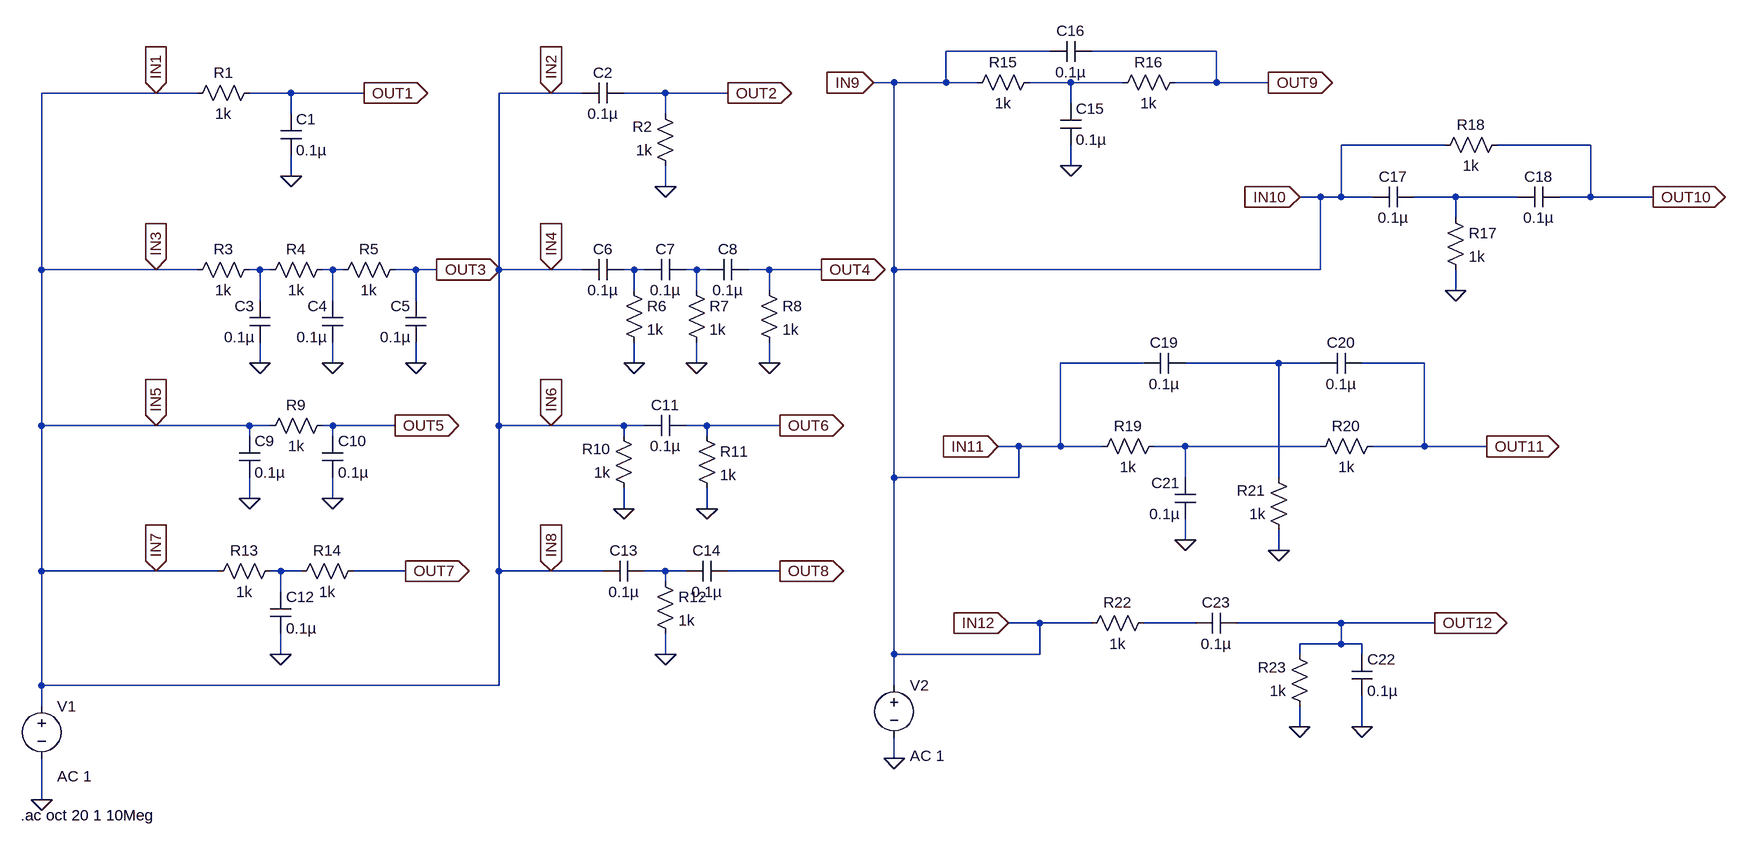
[diagram p0: schematic 1_filtry_sym.asc]
1_filtry_sym.asc, the LTspice schematic file:
Version 4
SHEET 1 2360 1236
WIRE 1296 0 1136 0
WIRE 1552 0 1360 0
WIRE 1056 48 1024 48
WIRE 1136 48 1136 0
WIRE 1136 48 1056 48
WIRE 1184 48 1136 48
WIRE 1328 48 1264 48
WIRE 1408 48 1328 48
WIRE 1552 48 1552 0
WIRE 1552 48 1488 48
WIRE 1632 48 1552 48
WIRE -80 64 -256 64
WIRE -16 64 -80 64
WIRE 128 64 64 64
WIRE 240 64 128 64
WIRE 528 64 448 64
WIRE 576 64 528 64
WIRE 704 64 640 64
WIRE 800 64 704 64
WIRE 1328 80 1328 48
WIRE 128 96 128 64
WIRE 704 96 704 64
WIRE 1904 144 1744 144
WIRE 2128 144 1984 144
WIRE 1328 176 1328 144
WIRE 128 192 128 160
WIRE 704 208 704 176
WIRE 1712 224 1680 224
WIRE 1744 224 1744 144
WIRE 1744 224 1712 224
WIRE 1792 224 1744 224
WIRE 1920 224 1856 224
WIRE 2016 224 1920 224
WIRE 2128 224 2128 144
WIRE 2128 224 2080 224
WIRE 2224 224 2128 224
WIRE 1920 256 1920 224
WIRE -256 336 -256 64
WIRE -80 336 -256 336
WIRE -16 336 -80 336
WIRE 80 336 64 336
WIRE 96 336 80 336
WIRE 192 336 176 336
WIRE 208 336 192 336
WIRE 320 336 288 336
WIRE 352 336 320 336
WIRE 448 336 448 64
WIRE 528 336 448 336
WIRE 576 336 528 336
WIRE 656 336 640 336
WIRE 672 336 656 336
WIRE 752 336 736 336
WIRE 768 336 752 336
WIRE 864 336 832 336
WIRE 944 336 864 336
WIRE 1056 336 1056 48
WIRE 1712 336 1712 224
WIRE 1712 336 1056 336
WIRE 656 368 656 336
WIRE 752 368 752 336
WIRE 864 368 864 336
WIRE 1920 368 1920 336
WIRE 80 384 80 336
WIRE 192 384 192 336
WIRE 320 384 320 336
WIRE 80 480 80 448
WIRE 192 480 192 448
WIRE 320 480 320 448
WIRE 656 480 656 448
WIRE 752 480 752 448
WIRE 864 480 864 448
WIRE 1440 480 1312 480
WIRE 1648 480 1504 480
WIRE 1712 480 1648 480
WIRE 1872 480 1776 480
WIRE -256 576 -256 336
WIRE -80 576 -256 576
WIRE 64 576 -80 576
WIRE 96 576 64 576
WIRE 192 576 176 576
WIRE 288 576 192 576
WIRE 448 576 448 336
WIRE 528 576 448 576
WIRE 640 576 528 576
WIRE 672 576 640 576
WIRE 768 576 736 576
WIRE 880 576 768 576
WIRE 64 592 64 576
WIRE 192 592 192 576
WIRE 640 592 640 576
WIRE 768 592 768 576
WIRE 1248 608 1216 608
WIRE 1312 608 1312 480
WIRE 1312 608 1248 608
WIRE 1376 608 1312 608
WIRE 1504 608 1456 608
WIRE 1712 608 1504 608
WIRE 1872 608 1872 480
WIRE 1872 608 1792 608
WIRE 1968 608 1872 608
WIRE 1056 656 1056 336
WIRE 1248 656 1248 608
WIRE 1248 656 1056 656
WIRE 1504 656 1504 608
WIRE 1648 656 1648 480
WIRE 64 688 64 656
WIRE 192 688 192 656
WIRE 640 704 640 672
WIRE 768 704 768 672
WIRE 1504 752 1504 720
WIRE 1648 768 1648 736
WIRE -256 800 -256 576
WIRE -80 800 -256 800
WIRE 16 800 -80 800
WIRE 112 800 96 800
WIRE 144 800 112 800
WIRE 304 800 224 800
WIRE 448 800 448 576
WIRE 528 800 448 800
WIRE 608 800 528 800
WIRE 704 800 672 800
WIRE 736 800 704 800
WIRE 880 800 800 800
WIRE 704 816 704 800
WIRE 112 832 112 800
WIRE 1280 880 1232 880
WIRE 1360 880 1280 880
WIRE 1520 880 1440 880
WIRE 1744 880 1584 880
WIRE 1888 880 1744 880
WIRE 1744 912 1744 880
WIRE 1744 912 1680 912
WIRE 1776 912 1744 912
WIRE 112 928 112 896
WIRE 704 928 704 896
WIRE 1056 928 1056 656
WIRE 1280 928 1280 880
WIRE 1280 928 1056 928
WIRE 1680 928 1680 912
WIRE 1776 928 1776 912
WIRE -256 976 -256 800
WIRE 448 976 448 800
WIRE 448 976 -256 976
WIRE 1056 976 1056 928
WIRE -256 1008 -256 976
WIRE 1680 1040 1680 1008
WIRE 1776 1040 1776 992
WIRE 1056 1088 1056 1056
WIRE -256 1152 -256 1088
FLAG 128 192 0
FLAG 704 208 0
FLAG 320 480 0
FLAG 192 480 0
FLAG 80 480 0
FLAG 656 480 0
FLAG 752 480 0
FLAG 864 480 0
FLAG 64 688 0
FLAG 192 688 0
FLAG 640 704 0
FLAG 768 704 0
FLAG 112 928 0
FLAG 704 928 0
FLAG 1328 176 0
FLAG 1920 368 0
FLAG 1504 752 0
FLAG 1648 768 0
FLAG 1680 1040 0
FLAG 1776 1040 0
FLAG -80 64 IN1
IOPIN -80 64 In
FLAG 528 64 IN2
IOPIN 528 64 In
FLAG -80 336 IN3
IOPIN -80 336 In
FLAG 528 336 IN4
IOPIN 528 336 In
FLAG -80 576 IN5
IOPIN -80 576 In
FLAG 528 576 IN6
IOPIN 528 576 In
FLAG -80 800 IN7
IOPIN -80 800 In
FLAG 528 800 IN8
IOPIN 528 800 In
FLAG 1024 48 IN9
IOPIN 1024 48 In
FLAG 1680 224 IN10
IOPIN 1680 224 In
FLAG 1216 608 IN11
IOPIN 1216 608 In
FLAG 1232 880 IN12
IOPIN 1232 880 In
FLAG 240 64 OUT1
IOPIN 240 64 Out
FLAG 800 64 OUT2
IOPIN 800 64 Out
FLAG 352 336 OUT3
IOPIN 352 336 Out
FLAG 944 336 OUT4
IOPIN 944 336 Out
FLAG 288 576 OUT5
IOPIN 288 576 Out
FLAG 880 576 OUT6
IOPIN 880 576 Out
FLAG 304 800 OUT7
IOPIN 304 800 Out
FLAG 880 800 OUT8
IOPIN 880 800 Out
FLAG 1632 48 OUT9
IOPIN 1632 48 Out
FLAG 2224 224 OUT10
IOPIN 2224 224 Out
FLAG 1968 608 OUT11
IOPIN 1968 608 Out
FLAG 1888 880 OUT12
IOPIN 1888 880 Out
FLAG -256 1152 0
FLAG 1056 1088 0
SYMBOL res 80 48 R90
WINDOW 0 0 56 VBottom 2
WINDOW 3 32 56 VTop 2
SYMATTR InstName R1
SYMATTR Value 1k
SYMATTR SpiceLine tol=5%
SYMBOL res 720 192 R180
WINDOW 0 36 76 Left 2
WINDOW 3 36 40 Left 2
SYMATTR InstName R2
SYMATTR Value 1k
SYMATTR SpiceLine tol=5
SYMBOL res -32 352 R270
WINDOW 0 32 56 VTop 2
WINDOW 3 0 56 VBottom 2
SYMATTR InstName R3
SYMATTR Value 1k
SYMATTR SpiceLine tol=5
SYMBOL res 80 352 R270
WINDOW 0 32 56 VTop 2
WINDOW 3 0 56 VBottom 2
SYMATTR InstName R4
SYMATTR Value 1k
SYMATTR SpiceLine tol=5
SYMBOL res 192 352 R270
WINDOW 0 32 56 VTop 2
WINDOW 3 0 56 VBottom 2
SYMATTR InstName R5
SYMATTR Value 1k
SYMATTR SpiceLine tol=5
SYMBOL cap 112 96 R0
SYMATTR InstName C1
SYMATTR Value 0.1µ
SYMBOL cap 640 48 R90
WINDOW 0 0 32 VBottom 2
WINDOW 3 32 32 VTop 2
SYMATTR InstName C2
SYMATTR Value 0.1µ
SYMBOL cap 96 448 R180
WINDOW 0 24 56 Left 2
WINDOW 3 24 8 Left 2
SYMATTR InstName C3
SYMATTR Value 0.1µ
SYMBOL cap 208 448 R180
WINDOW 0 24 56 Left 2
WINDOW 3 24 8 Left 2
SYMATTR InstName C4
SYMATTR Value 0.1µ
SYMBOL cap 336 448 R180
WINDOW 0 24 56 Left 2
WINDOW 3 24 8 Left 2
SYMATTR InstName C5
SYMATTR Value 0.1µ
SYMBOL cap 640 320 R90
WINDOW 0 0 32 VBottom 2
WINDOW 3 32 32 VTop 2
SYMATTR InstName C6
SYMATTR Value 0.1µ
SYMBOL cap 736 320 R90
WINDOW 0 0 32 VBottom 2
WINDOW 3 32 32 VTop 2
SYMATTR InstName C7
SYMATTR Value 0.1µ
SYMBOL cap 832 320 R90
WINDOW 0 0 32 VBottom 2
WINDOW 3 32 32 VTop 2
SYMATTR InstName C8
SYMATTR Value 0.1µ
SYMBOL res 640 352 R0
SYMATTR InstName R6
SYMATTR Value 1k
SYMATTR SpiceLine tol=5
SYMBOL res 736 352 R0
SYMATTR InstName R7
SYMATTR Value 1k
SYMATTR SpiceLine tol=5
SYMBOL res 848 352 R0
SYMATTR InstName R8
SYMATTR Value 1k
SYMATTR SpiceLine tol=5
SYMBOL cap 48 592 R0
SYMATTR InstName C9
SYMATTR Value 0.1µ
SYMBOL cap 176 592 R0
SYMATTR InstName C10
SYMATTR Value 0.1µ
SYMBOL cap 736 560 R90
WINDOW 0 0 32 VBottom 2
WINDOW 3 32 32 VTop 2
SYMATTR InstName C11
SYMATTR Value 0.1µ
SYMBOL res 192 560 R90
WINDOW 0 0 56 VBottom 2
WINDOW 3 32 56 VTop 2
SYMATTR InstName R9
SYMATTR Value 1k
SYMATTR SpiceLine tol=5
SYMBOL res 656 688 R180
WINDOW 0 36 76 Left 2
WINDOW 3 36 40 Left 2
SYMATTR InstName R10
SYMATTR Value 1k
SYMATTR SpiceLine tol=5
SYMBOL res 752 576 R0
SYMATTR InstName R11
SYMATTR Value 1k
SYMATTR SpiceLine tol=5
SYMBOL res 688 800 R0
SYMATTR InstName R12
SYMATTR Value 1k
SYMATTR SpiceLine tol=5
SYMBOL res 112 784 R90
WINDOW 0 0 56 VBottom 2
WINDOW 3 32 56 VTop 2
SYMATTR InstName R13
SYMATTR Value 1k
SYMATTR SpiceLine tol=5
SYMBOL res 240 784 R90
WINDOW 0 0 56 VBottom 2
WINDOW 3 32 56 VTop 2
SYMATTR InstName R14
SYMATTR Value 1k
SYMATTR SpiceLine tol=5
SYMBOL cap 96 832 R0
SYMATTR InstName C12
SYMATTR Value 0.1µ
SYMBOL cap 672 784 R90
WINDOW 0 0 32 VBottom 2
WINDOW 3 32 32 VTop 2
SYMATTR InstName C13
SYMATTR Value 0.1µ
SYMBOL cap 800 784 R90
WINDOW 0 0 32 VBottom 2
WINDOW 3 32 32 VTop 2
SYMATTR InstName C14
SYMATTR Value 0.1µ
SYMBOL cap 1312 80 R0
SYMATTR InstName C15
SYMATTR Value 0.1µ
SYMBOL cap 1360 -16 R90
WINDOW 0 0 32 VBottom 2
WINDOW 3 32 32 VTop 2
SYMATTR InstName C16
SYMATTR Value 0.1µ
SYMBOL res 1280 32 R90
WINDOW 0 0 56 VBottom 2
WINDOW 3 32 56 VTop 2
SYMATTR InstName R15
SYMATTR Value 1k
SYMATTR SpiceLine tol=5
SYMBOL res 1504 32 R90
WINDOW 0 0 56 VBottom 2
WINDOW 3 32 56 VTop 2
SYMATTR InstName R16
SYMATTR Value 1k
SYMATTR SpiceLine tol=5
SYMBOL cap 1856 208 R90
WINDOW 0 0 32 VBottom 2
WINDOW 3 32 32 VTop 2
SYMATTR InstName C17
SYMATTR Value 0.1µ
SYMBOL res 1904 240 R0
SYMATTR InstName R17
SYMATTR Value 1k
SYMATTR SpiceLine tol=5
SYMBOL res 2000 128 R90
WINDOW 0 0 56 VBottom 2
WINDOW 3 32 56 VTop 2
SYMATTR InstName R18
SYMATTR Value 1k
SYMATTR SpiceLine tol=5
SYMBOL cap 2080 208 R90
WINDOW 0 0 32 VBottom 2
WINDOW 3 32 32 VTop 2
SYMATTR InstName C18
SYMATTR Value 0.1µ
SYMBOL cap 1504 464 R90
WINDOW 0 0 32 VBottom 2
WINDOW 3 32 32 VTop 2
SYMATTR InstName C19
SYMATTR Value 0.1µ
SYMBOL cap 1776 464 R90
WINDOW 0 0 32 VBottom 2
WINDOW 3 32 32 VTop 2
SYMATTR InstName C20
SYMATTR Value 0.1µ
SYMBOL cap 1520 720 R180
WINDOW 0 24 56 Left 2
WINDOW 3 24 8 Left 2
SYMATTR InstName C21
SYMATTR Value 0.1µ
SYMBOL res 1472 592 R90
WINDOW 0 0 56 VBottom 2
WINDOW 3 32 56 VTop 2
SYMATTR InstName R19
SYMATTR Value 1k
SYMATTR SpiceLine tol=5
SYMBOL res 1808 592 R90
WINDOW 0 0 56 VBottom 2
WINDOW 3 32 56 VTop 2
SYMATTR InstName R20
SYMATTR Value 1k
SYMATTR SpiceLine tol=5
SYMBOL res 1664 752 R180
WINDOW 0 36 76 Left 2
WINDOW 3 36 40 Left 2
SYMATTR InstName R21
SYMATTR Value 1k
SYMATTR SpiceLine tol=5
SYMBOL res 1456 864 R90
WINDOW 0 0 56 VBottom 2
WINDOW 3 32 56 VTop 2
SYMATTR InstName R22
SYMATTR Value 1k
SYMATTR SpiceLine tol=5
SYMBOL res 1696 1024 R180
WINDOW 0 36 76 Left 2
WINDOW 3 36 40 Left 2
SYMATTR InstName R23
SYMATTR Value 1k
SYMATTR SpiceLine tol=5
SYMBOL cap 1760 928 R0
SYMATTR InstName C22
SYMATTR Value 0.1µ
SYMBOL cap 1584 864 R90
WINDOW 0 0 32 VBottom 2
WINDOW 3 32 32 VTop 2
SYMATTR InstName C23
SYMATTR Value 0.1µ
SYMBOL voltage -256 992 R0
WINDOW 123 24 124 Left 2
WINDOW 39 0 0 Left 2
SYMATTR Value2 AC 1
SYMATTR InstName V1
SYMATTR Value ""
SYMBOL voltage 1056 960 R0
WINDOW 123 24 124 Left 2
WINDOW 39 0 0 Left 2
SYMATTR Value2 AC 1
SYMATTR InstName V2
SYMATTR Value ""
TEXT -288 1176 Left 2 !.ac oct 20 1 10Meg

The netlist it stands for:
* 1_filtry_sym.asc
R1 OUT1 IN8 1k tol=5%
R2 0 OUT2 1k tol=5
R3 IN8 N003 1k tol=5
R4 N003 N004 1k tol=5
R5 N004 OUT3 1k tol=5
C1 OUT1 0 0.1µ
C2 OUT2 IN8 0.1µ
C3 0 N003 0.1µ
C4 0 N004 0.1µ
C5 0 OUT3 0.1µ
C6 N005 IN8 0.1µ
C7 N006 N005 0.1µ
C8 OUT4 N006 0.1µ
R6 N005 0 1k tol=5
R7 N006 0 1k tol=5
R8 OUT4 0 1k tol=5
C9 IN8 0 0.1µ
C10 OUT5 0 0.1µ
C11 OUT6 IN8 0.1µ
R9 OUT5 IN8 1k tol=5
R10 0 IN8 1k tol=5
R11 OUT6 0 1k tol=5
R12 N010 0 1k tol=5
R13 N009 IN8 1k tol=5
R14 OUT7 N009 1k tol=5
C12 N009 0 0.1µ
C13 N010 IN8 0.1µ
C14 OUT8 N010 0.1µ
C15 N001 0 0.1µ
C16 OUT9 IN12 0.1µ
R15 N001 IN12 1k tol=5
R16 OUT9 N001 1k tol=5
C17 N002 IN12 0.1µ
R17 N002 0 1k tol=5
R18 OUT10 IN12 1k tol=5
C18 OUT10 N002 0.1µ
C19 N007 IN12 0.1µ
C20 OUT11 N007 0.1µ
C21 0 N008 0.1µ
R19 N008 IN12 1k tol=5
R20 OUT11 N008 1k tol=5
R21 0 N007 1k tol=5
R22 N011 IN12 1k tol=5
R23 0 OUT12 1k tol=5
C22 OUT12 0 0.1µ
C23 OUT12 N011 0.1µ
V1 IN8 0 AC 1
V2 IN12 0 AC 1
.ac oct 20 1 10Meg
.backanno
.end